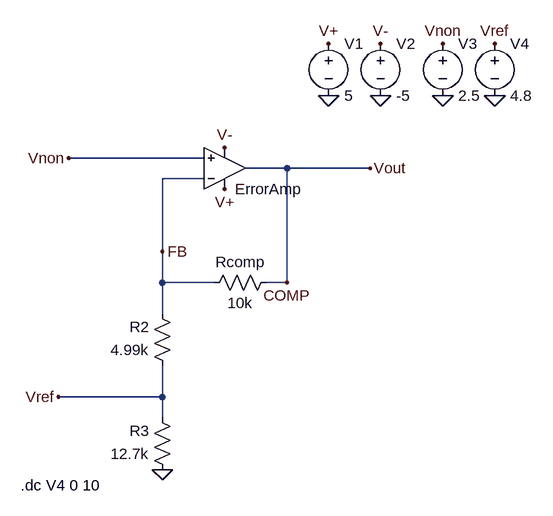
[diagram p0: schematic erroramp.asc]
erroramp.asc, the LTspice schematic file:
Version 4
SHEET 1 880 680
WIRE 144 112 -64 112
WIRE 272 128 208 128
WIRE 400 128 272 128
WIRE 144 144 80 144
WIRE 80 256 80 144
WIRE 80 304 80 256
WIRE 160 304 80 304
WIRE 272 304 272 128
WIRE 272 304 240 304
WIRE 80 352 80 304
WIRE 80 480 80 432
WIRE 80 480 -80 480
WIRE 80 512 80 480
FLAG 336 16 0
FLAG 416 16 0
FLAG 512 16 0
FLAG 336 -64 V+
FLAG 416 -64 V-
FLAG 512 -64 Vnon
FLAG 592 16 0
FLAG 592 -64 Vref
FLAG 80 592 0
FLAG -80 480 Vref
FLAG 400 128 Vout
FLAG -64 112 Vnon
FLAG 176 96 V-
FLAG 176 160 V+
FLAG 80 256 FB
FLAG 272 304 COMP
SYMBOL OpAmps\\UniversalOpAmp 176 128 M180
SYMATTR InstName ErrorAmp
SYMBOL voltage 336 -80 R0
SYMATTR InstName V1
SYMATTR Value 5
SYMBOL voltage 416 -80 R0
SYMATTR InstName V2
SYMATTR Value -5
SYMBOL voltage 512 -80 R0
SYMATTR InstName V3
SYMATTR Value 2.5
SYMBOL voltage 592 -80 R0
SYMATTR InstName V4
SYMATTR Value 4.8
SYMBOL res 256 288 R90
WINDOW 0 0 56 VBottom 2
WINDOW 3 32 56 VTop 2
SYMATTR InstName Rcomp
SYMATTR Value 10k
SYMBOL res 96 448 R180
WINDOW 0 36 76 Left 2
WINDOW 3 36 40 Left 2
SYMATTR InstName R2
SYMATTR Value 4.99k
SYMBOL res 96 608 R180
WINDOW 0 36 76 Left 2
WINDOW 3 36 40 Left 2
SYMATTR InstName R3
SYMATTR Value 12.7k
TEXT -138 616 Left 2 !.dc V4 0 10

The netlist it stands for:
* erroramp.asc
XErrorAmp Vnon FB V+ V- COMP level1 Avol=1Meg GBW=10Meg Vos=0 En=0 Enk=0 In=0 Ink=0 Rin=500Meg  ; pins In+ In- V+ V- OUT
V1 V+ 0 5
V2 V- 0 -5
V3 Vnon 0 2.5
V4 Vref 0 4.8
Rcomp COMP FB 10k
R2 Vref FB 4.99k
R3 0 Vref 12.7k
.dc V4 0 10
.lib UniversalOpAmp1.lib
.backanno
.end